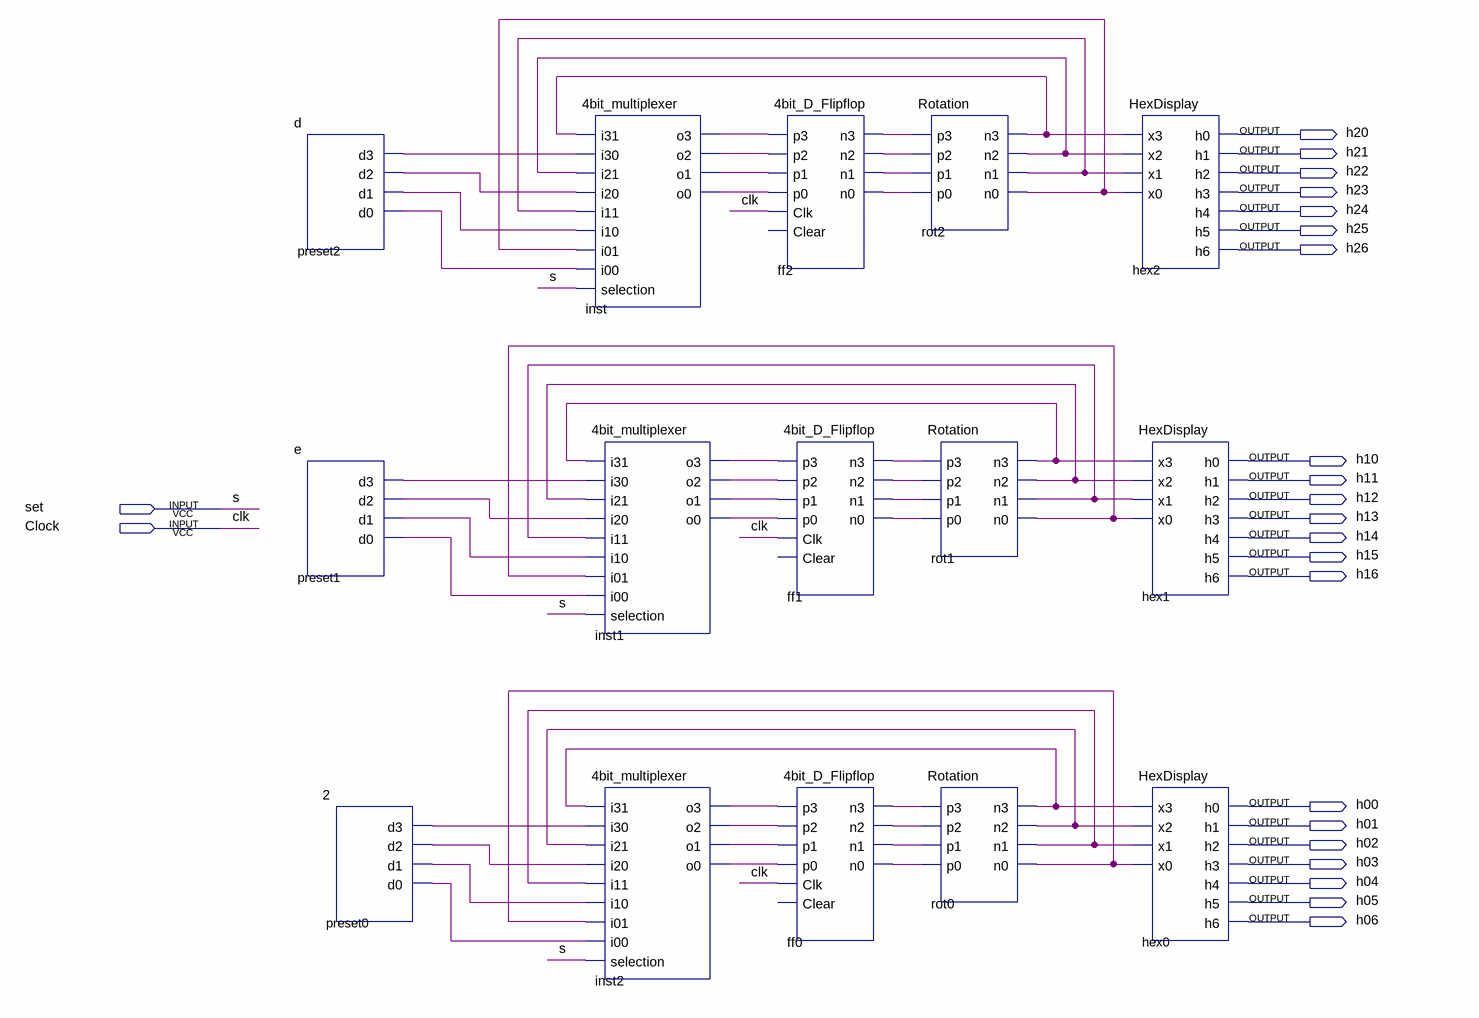
[diagram p0: schematic sheet]
// Quartus schematic Rotate.bdf as structural Verilog: 15 symbols, 23 pins
module Rotate (
  input  set,
  input  Clock,
  output h20,
  output h21,
  output h22,
  output h23,
  output h24,
  output h25,
  output h26,
  output h10,
  output h11,
  output h12,
  output h13,
  output h14,
  output h15,
  output h16,
  output h00,
  output h01,
  output h02,
  output h03,
  output h04,
  output h05,
  output h06
);

  wire ff0_n0, ff0_n1, ff0_n2, ff0_n3, ff1_n0, ff1_n1, ff1_n2, ff1_n3, ff2_n0, ff2_n1, ff2_n2, ff2_n3,
       inst1_o0, inst1_o1, inst1_o2, inst1_o3, inst2_o0, inst2_o1, inst2_o2, inst2_o3, inst_o0, inst_o1,
       inst_o2, inst_o3, preset0_d0, preset0_d1, preset0_d2, preset0_d3, preset1_d0, preset1_d1, preset1_d2,
       preset1_d3, preset2_d0, preset2_d1, preset2_d2, preset2_d3, rot0_n0, rot0_n1, rot0_n2, rot0_n3,
       rot1_n0, rot1_n1, rot1_n2, rot1_n3, rot2_n0, rot2_n1, rot2_n2, rot2_n3;

  d preset2 (.d3(preset2_d3), .d2(preset2_d2), .d1(preset2_d1), .d0(preset2_d0));
  e preset1 (.d3(preset1_d3), .d2(preset1_d2), .d1(preset1_d1), .d0(preset1_d0));
  \2  preset0 (.d3(preset0_d3), .d2(preset0_d2), .d1(preset0_d1), .d0(preset0_d0));
  \4bit_multiplexer  inst (
    .i31(rot2_n3), .i30(preset2_d3), .i21(rot2_n2), .i20(preset2_d2), .i11(rot2_n1), .i10(preset2_d1),
    .i01(rot2_n0), .i00(preset2_d0), .selection(set), .o3(inst_o3), .o2(inst_o2), .o1(inst_o1), .o0(inst_o0));
  \4bit_multiplexer  inst1 (
    .i31(rot1_n3), .i30(preset1_d3), .i21(rot1_n2), .i20(preset1_d2), .i11(rot1_n1), .i10(preset1_d1),
    .i01(rot1_n0), .i00(preset1_d0), .selection(set), .o3(inst1_o3), .o2(inst1_o2), .o1(inst1_o1),
    .o0(inst1_o0));
  \4bit_multiplexer  inst2 (
    .i31(rot0_n3), .i30(preset0_d3), .i21(rot0_n2), .i20(preset0_d2), .i11(rot0_n1), .i10(preset0_d1),
    .i01(rot0_n0), .i00(preset0_d0), .selection(set), .o3(inst2_o3), .o2(inst2_o2), .o1(inst2_o1),
    .o0(inst2_o0));
  \4bit_D_Flipflop  ff2 (
    .p3(inst_o3), .p2(inst_o2), .p1(inst_o1), .p0(inst_o0), .Clk(Clock), .n3(ff2_n3), .n2(ff2_n2),
    .n1(ff2_n1), .n0(ff2_n0));  // open: Clear
  \4bit_D_Flipflop  ff1 (
    .p3(inst1_o3), .p2(inst1_o2), .p1(inst1_o1), .p0(inst1_o0), .Clk(Clock), .n3(ff1_n3), .n2(ff1_n2),
    .n1(ff1_n1), .n0(ff1_n0));  // open: Clear
  \4bit_D_Flipflop  ff0 (
    .p3(inst2_o3), .p2(inst2_o2), .p1(inst2_o1), .p0(inst2_o0), .Clk(Clock), .n3(ff0_n3), .n2(ff0_n2),
    .n1(ff0_n1), .n0(ff0_n0));  // open: Clear
  Rotation rot2 (
    .p3(ff2_n3), .p2(ff2_n2), .p1(ff2_n1), .p0(ff2_n0), .n3(rot2_n3), .n2(rot2_n2), .n1(rot2_n1), .n0(rot2_n0));
  Rotation rot1 (
    .p3(ff1_n3), .p2(ff1_n2), .p1(ff1_n1), .p0(ff1_n0), .n3(rot1_n3), .n2(rot1_n2), .n1(rot1_n1), .n0(rot1_n0));
  Rotation rot0 (
    .p3(ff0_n3), .p2(ff0_n2), .p1(ff0_n1), .p0(ff0_n0), .n3(rot0_n3), .n2(rot0_n2), .n1(rot0_n1), .n0(rot0_n0));
  HexDisplay hex2 (
    .x3(rot2_n3), .x2(rot2_n2), .x1(rot2_n1), .x0(rot2_n0), .h0(h20), .h1(h21), .h2(h22), .h3(h23), .h4(h24),
    .h5(h25), .h6(h26));
  HexDisplay hex1 (
    .x3(rot1_n3), .x2(rot1_n2), .x1(rot1_n1), .x0(rot1_n0), .h0(h10), .h1(h11), .h2(h12), .h3(h13), .h4(h14),
    .h5(h15), .h6(h16));
  HexDisplay hex0 (
    .x3(rot0_n3), .x2(rot0_n2), .x1(rot0_n1), .x0(rot0_n0), .h0(h00), .h1(h01), .h2(h02), .h3(h03), .h4(h04),
    .h5(h05), .h6(h06));

  // Other names for the same wires on the sheet: clk = Clock; s = set
endmodule
